# EAGLE design LPC1114_Bare_Metal_v01 (EAGLE 6.5.0)
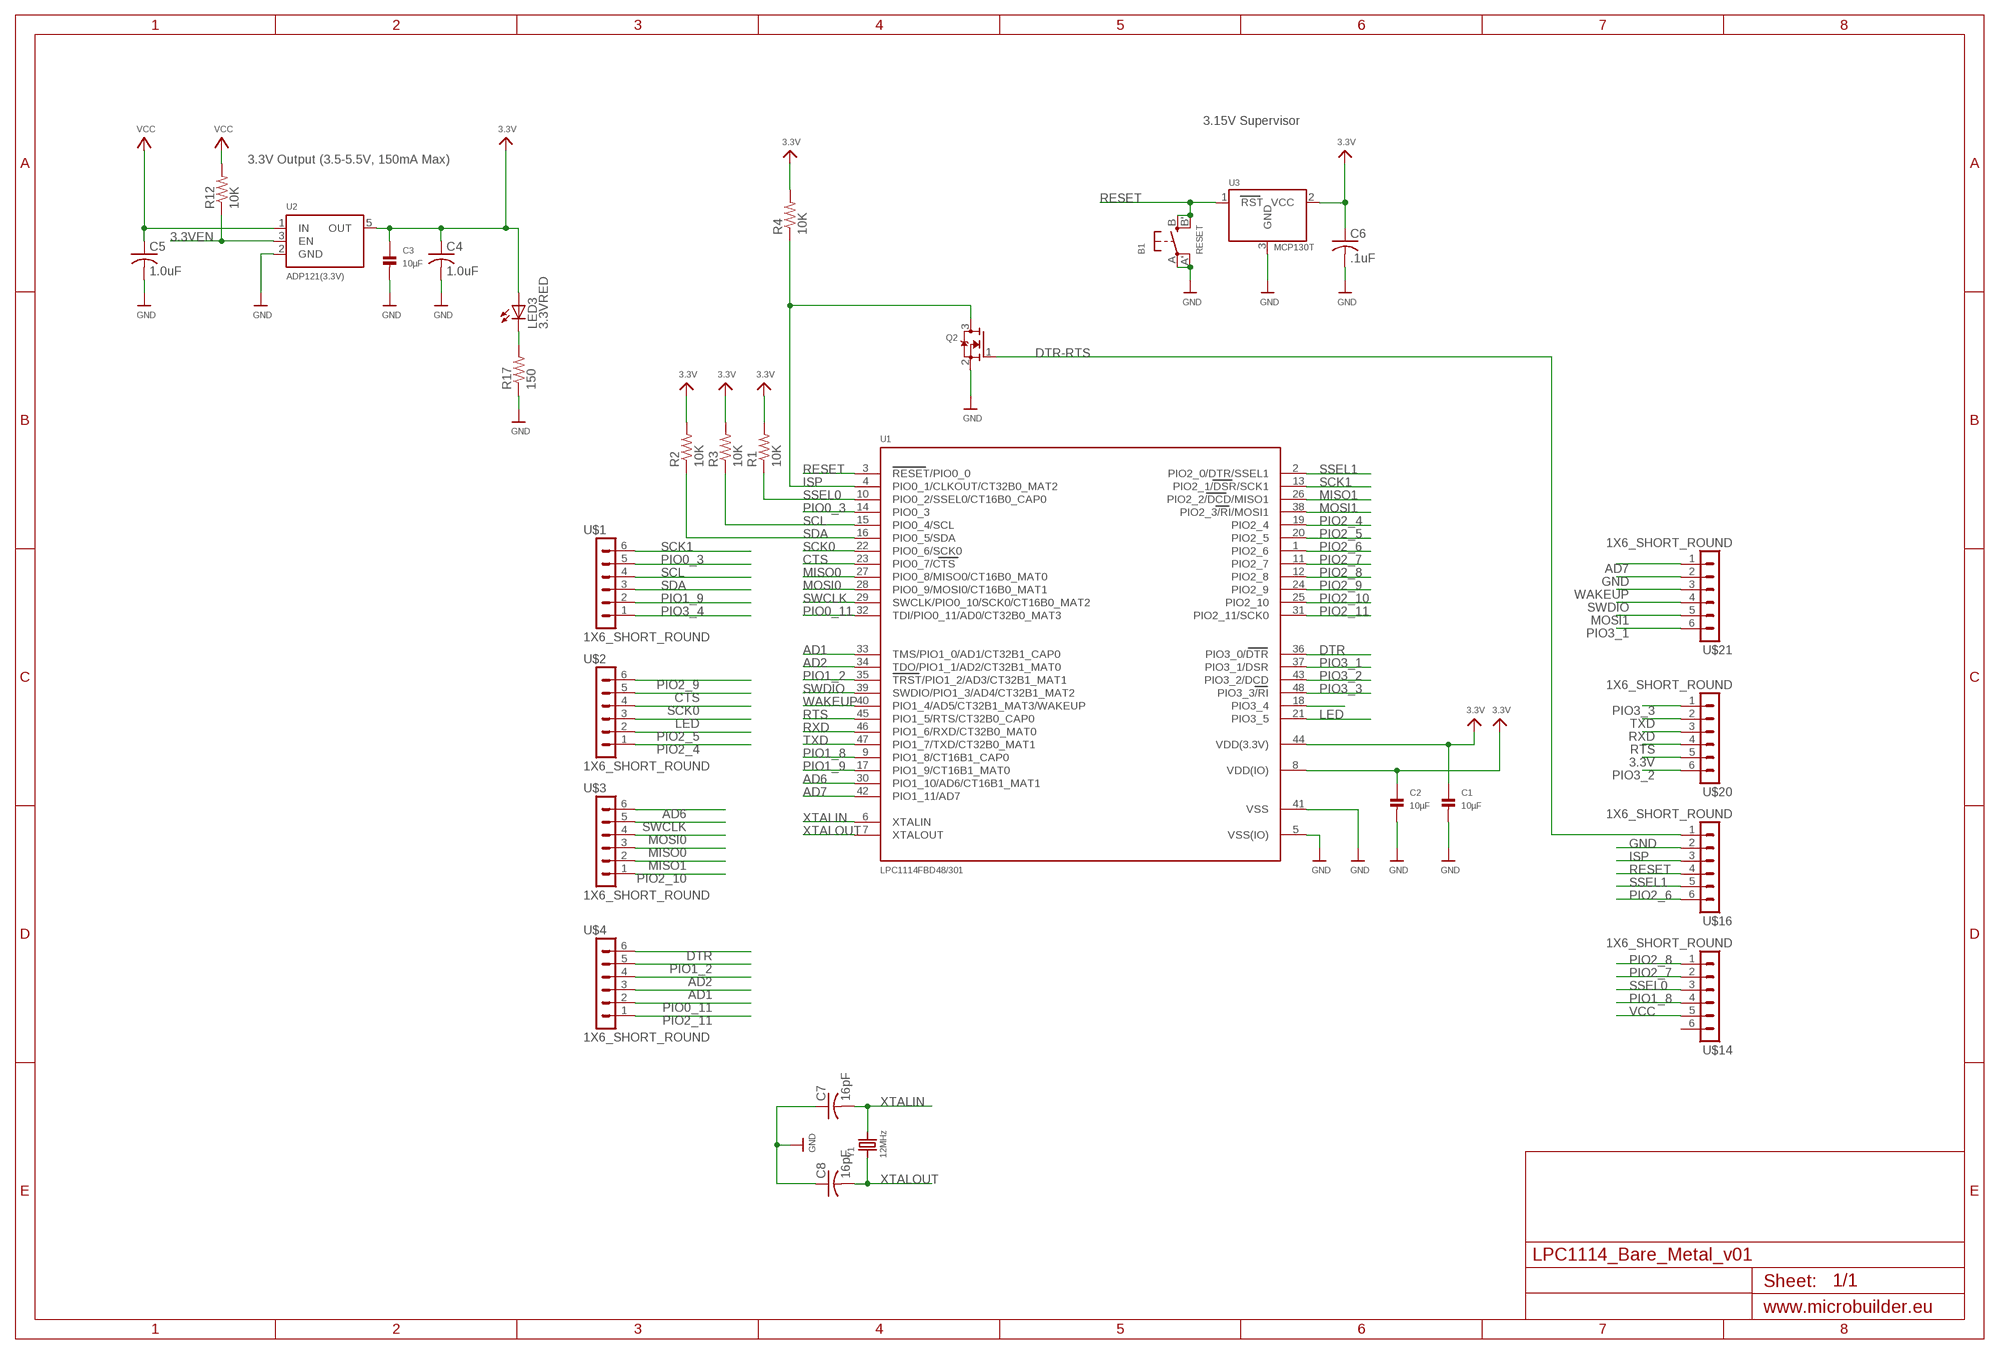
[diagram p0: schematic, sheet 1]

## Parts
B1  RESET  BUTTON_SMT  [EVQ-Q2]
C1  10µF  CAP_CERAMIC0805  [0805]
C2  10µF  CAP_CERAMIC0805  [0805]
C3  10µF  CAP_CERAMIC0805  [0805]
C4  1.0uF  C-USC0402K  [C0402K]
C5  1.0uF  C-USC0402K  [C0402K]
C6  .1uF  C-USC0402K  [C0402K]
C7  16pF  C-USC0402K  [C0402K]
C8  16pF  C-USC0402K  [C0402K]
LED3  3.3VRED  LEDSML0603  [SML0603]
Q2  MOSFET-NREFLOW  [SOT23]
R1  10K  R-US_R0402  [R0402]
R2  10K  R-US_R0402  [R0402]
R3  10K  R-US_R0402  [R0402]
R4  10K  R-US_R0402  [R0402]
R12  10K  R-US_R0402  [R0402]
R17  150  R-US_R0402  [R0402]
U1  LPC1114FBD48/301  LPC1113/4  [LQFP48]
U2  ADP121(3.3V)  ADP121  [SOT23-5]
U3  MCP130T  MCP130TREFLOW  [SOT23-R]
U$1  1X6_SHORT_ROUND  [1X6_SHORT_ROUND]
U$2  1X6_SHORT_ROUND  [1X6_SHORT_ROUND]
U$3  1X6_SHORT_ROUND  [1X6_SHORT_ROUND]
U$4  1X6_SHORT_ROUND  [1X6_SHORT_ROUND]
U$14  1X6_SHORT_ROUND  [1X6_SHORT_ROUND]
U$16  1X6_SHORT_ROUND  [1X6_SHORT_ROUND]
U$20  1X6_SHORT_ROUND  [1X6_SHORT_ROUND]
U$21  1X6_SHORT_ROUND  [1X6_SHORT_ROUND]
Y1  12MHz  CRYSTALTHIN  [CRYSTAL_3.2X2.5]

## Nets
3.3V: C1.1 C2.1 C3.1 C4.1 C6.1 LED3.A R1.2 R2.2 R3.2 R4.2 U1.8(VDD(IO)) U1.44(VDD(3.3V)) U2.5(OUT) U3.2(VCC) U$20.5
3.3VEN: R12.1 U2.3(EN)
AD1: U1.33(TMS/PIO1_0/AD1/CT32B1_CAP0) U$4.3
AD2: U1.34(TDO/PIO1_1/AD2/CT32B1_MAT0) U$4.4
AD6: U1.30(PIO1_10/AD6/CT16B1_MAT1) U$3.6
AD7: U1.42(PIO1_11/AD7) U$21.1
CTS: U1.23(PIO0_7/CTS) U$2.5
DTR: U1.36(PIO3_0/DTR) U$4.6
DTR-RTS: Q2.1(G) U$16.1
GND: B1.A'(P1) B1.A(P) C1.2 C2.2 C3.2 C4.2 C5.2 C6.2 C7.1 C8.1 Q2.2(S) R17.1 U1.5(VSS(IO)) U1.41(VSS) U2.2(GND) U3.3(GND) U$16.2 U$21.2
ISP: Q2.3(D) R4.1 U1.4(PIO0_1/CLKOUT/CT32B0_MAT2) U$16.3
LED: U1.21(PIO3_5) U$2.3
MISO0: U1.27(PIO0_8/MISO0/CT16B0_MAT0) U$3.3
MISO1: U1.26(PIO2_2/DCD/MISO1) U$3.2
MOSI0: U1.28(PIO0_9/MOSI0/CT16B0_MAT1) U$3.4
MOSI1: U1.38(PIO2_3/RI/MOSI1) U$21.5
N$10: LED3.C R17.2
PIO0_3: U1.14(PIO0_3) U$1.5
PIO0_11: U1.32(TDI/PIO0_11/AD0/CT32B0_MAT3) U$4.2
PIO1_2: U1.35(TRST/PIO1_2/AD3/CT32B1_MAT1) U$4.5
PIO1_8: U1.9(PIO1_8/CT16B1_CAP0) U$14.4
PIO1_9: U1.17(PIO1_9/CT16B1_MAT0) U$1.2
PIO2_4: U1.19(PIO2_4) U$2.1
PIO2_5: U1.20(PIO2_5) U$2.2
PIO2_6: U1.1(PIO2_6) U$16.6
PIO2_7: U1.11(PIO2_7) U$14.2
PIO2_8: U1.12(PIO2_8) U$14.1
PIO2_9: U1.24(PIO2_9) U$2.6
PIO2_10: U1.25(PIO2_10) U$3.1
PIO2_11: U1.31(PIO2_11/SCK0) U$4.1
PIO3_1: U1.37(PIO3_1/DSR) U$21.6
PIO3_2: U1.43(PIO3_2/DCD) U$20.6
PIO3_3: U1.48(PIO3_3/RI) U$20.1
PIO3_4: U1.18(PIO3_4) U$1.1
RESET: B1.B'(S1) B1.B(S) U1.3(RESET/PIO0_0) U3.1(RST) U$16.4
RTS: U1.45(PIO1_5/RTS/CT32B0_CAP0) U$20.4
RXD: U1.46(PIO1_6/RXD/CT32B0_MAT0) U$20.3
SCK0: U1.22(PIO0_6/SCK0) U$2.4
SCK1: U1.13(PIO2_1/DSR/SCK1) U$1.6
SCL: R3.1 U1.15(PIO0_4/SCL) U$1.4
SDA: R2.1 U1.16(PIO0_5/SDA) U$1.3
SSEL0: R1.1 U1.10(PIO0_2/SSEL0/CT16B0_CAP0) U$14.3
SSEL1: U1.2(PIO2_0/DTR/SSEL1) U$16.5
SWCLK: U1.29(SWCLK/PIO0_10/SCK0/CT16B0_MAT2) U$3.5
SWDIO: U1.39(SWDIO/PIO1_3/AD4/CT32B1_MAT2) U$21.4
TXD: U1.47(PIO1_7/TXD/CT32B0_MAT1) U$20.2
VCC: C5.1 R12.2 U2.1(IN) U$14.5
WAKEUP: U1.40(PIO1_4/AD5/CT32B1_MAT3/WAKEUP) U$21.3
XTALIN: C7.2 U1.6(XTALIN) Y1.2
XTALOUT: C8.2 U1.7(XTALOUT) Y1.1
Unconnected: U$14.6

## Notes on the sheet
- 3.15V Supervisor
- 3.3V Output (3.5-5.5V, 150mA Max)

## Library data of the parts
B1 = microbuilder:BUTTON_SMT: SMT Push Button (6mm) Digikey: P12940SCT-ND
C1-C3 = microbuilder:CAP_CERAMIC: Ceramic Capacitors 0603 - 0603 Surface Mount Capacitors 3pF 250V +/-0.1pF RF Ceramic Capacitor[Digikey: 712-1347-1-ND] 16 pF 50V 5% Ceramic Capacitor[Digikey: 445-5051-2-ND] 18 pF 250V 5% RF Ceramic Capcitor [Digikey: 478-3505-1-ND] 22 pF 50V Ceramic Capacitor [Digikey: PCC220ACVTR-ND] 33 pF 50V 5% Ceramic Capacitor 56 pF 250V 5% C0G RF Ceramic Capcitor [Digikey: 490-4867-1-ND] 680 pF 50V Ceramic Capacitor 2200 pF 50V 5% C0G Ceramic Capacitor [Digikey: 445-1297-1-ND] 5600 pF 100V 5% X7R Ceramic Capacitor [Digikey: 478-3711-1-ND] 0.1 µF 25V 10% Ceramic Capacitor [Digikey: PCC2277TR-ND] 0.22 µF 16V 10% X7R Ceramic Capacitor [Digikey: 445-1318-1-ND] 1.0 µF 25V 10% Ceramic Capacitor [Digikey: 445-5146-2-ND] 0805 - 0805 Surface Mount Capacitors 220 pF 250V 2% RF Ceramic Capacitor [Digikey: 712-1398-1-ND] 1000 pF 50V 2% NP0 Ceramic Capacitor [Digikey: 478-3760-1-ND] 0.1 µF 25V 10% Ceramic Capacitor [Digikey: PCC1828TR-ND] 1.0 µF 16V 10% Ceramic Capacitor[Digikey: 490-1691-2-ND] 10.0 µF 10V 10% Ceramic Capacitor[Digikey: 709-1228-1-ND] 1206 - 1206 Surface Mount Capacitors
C4-C8 = resistor:C-US: CAPACITOR, American symbol
LED3 = led:LED: LED OSRAM: - CHIPLED LG R971, LG N971, LY N971, LG Q971, LY Q971, LO R971, LY R971 LH N974, LH R974 LS Q976, LO Q976, LY Q976 LO Q996 - Hyper CHIPLED LW Q18S LB Q993, LB Q99A, LB R99A - SideLED LS A670, LO A670, LY A670, LG A670, LP A670 LB A673, LV A673, LT A673, LW A673 LH A674 LY A675 LS A676, LA A676, LO A676, LY A676, LW A676 LS A679, LY A679, LG A679 - Hyper Micro SIDELED® LS Y876, LA Y876, LO Y876, LY Y876 LT Y87S - SmartLED LW L88C, LW L88S LB L89C, LB L89S, LG L890 LS L89K, LO L89K, LY L89K LS L896, LA L896, LO L896, LY L896 - TOPLED LS T670, LO T670, LY T670, LG T670, LP T670 LSG T670, LSP T670, LSY T670, LOP T670, LYG T670 LG T671, LOG T671, LSG T671 LB T673, LV T673, LT T673, LW T673 LH T674 LS T676, LA T676, LO T676, LY T676, LB T676, LH T676, LSB T676, LW T676 LB T67C, LV T67C, LT T67C, LS T67K, LO T67K, LY T67K, LW E67C LS E67B, LA E67B, LO E67B, LY E67B, LB E67C, LV E67C, LT E67C LW T67C LS T679, LY T679, LG T679 LS T770, LO T770, LY T770, LG T770, LP T770 LB T773, LV T773, LT T773, LW T773 LH T774 LS E675, LA E675, LY E675, LS T675 LS T776, LA T776, LO T776, LY T776, LB T776 LHGB T686 LT T68C, LB T68C - Hyper Mini TOPLED® LB M676 - Mini TOPLED Santana® LG M470 LS M47K, LO M47K, LY M47K Source: http://www.osram.convergy.de LUXEON: - LUMILED® LXK2-PW12-R00, LXK2-PW12-S00, LXK2-PW14-U00, LXK2-PW14-V00 LXK2-PM12-R00, LXK2-PM12-S00, LXK2-PM14-U00 LXK2-PE12-Q00, LXK2-PE12-R00, LXK2-PE12-S00, LXK2-PE14-T00, LXK2-PE14-U00 LXK2-PB12-K00, LXK2-PB12-L00, LXK2-PB12-M00, LXK2-PB14-N00, LXK2-PB14-P00, LXK2-PB14-Q00 LXK2-PR12-L00, LXK2-PR12-M00, LXK2-PR14-Q00, LXK2-PR14-R00 LXK2-PD12-Q00, LXK2-PD12-R00, LXK2-PD12-S00 LXK2-PH12-R00, LXK2-PH12-S00 LXK2-PL12-P00, LXK2-PL12-Q00, LXK2-PL12-R00 Source: www.luxeon.com KINGBRIGHT: KA-3528ASYC Source: www.kingbright.com
Q2 = adafruit:MOSFET-N: N-Channel Mosfet 2N7002E - 60V 260mA SOT23 [Digikey: 2N7002ET1GOSTR-ND] - REEL BSH103 - 30V 850mA SOT23 [Digikey: 568-5013-1-ND]
R1-R4 R12 R17 = resistor:R-US_: RESISTOR, American symbol
U1 = microbuilder:LPC1113/4: LPC1113/4 MCU QFP48 Package ARM Cortex M0, 50MHz Operation, 8 Channel 10-Bit ADC, 1²C, 2xSPI, UART, 2x16 Bit and 2x32 Bit Timers, Internal 12MHz Oscillator, 1.8-3.6V operation. Model Flash SRAM Part N°: Digikey # LPC1113 24KB 8KB LPC1113FBD48/301 TBD LPC1114 32KB 8KB LPC1114FBD48/301 TBD
U2 = microbuilder:ADP121: LDO Fixed Voltage Regulator 150mA The ADP121 voltage regulator is ideal for regulating battery or solar power due to it's very low foreward voltage drop (maximum 90mV at 150mA). Forward Voltage Dropout: 90mV at 150mA Input Voltage Range: 2.3V-5.5V Output Voltage Range: 1.2V-3.3V (depending on model) Digikey: 3.3V - ADP121-AUJZ33R7CT-ND
U3 = microbuilder:MCP130T: MCP130T Voltage Supervisor (Active Low) Voltage supervisors will put the MCU in a reset state if the voltage drops below a pre-determined level. SOT23-R/SOT23-W: Voltage Supervisor - 3.15V Active Low Note: Use the "Reflow" footprint when working with solder paste, and the "Wave" footprint when soldering by hand with a soldering iron (the latter has larger pads that are easier to solder by hand). Digikey: MCP130T-315I/TTCT-ND
U$1-U$4 U$14 U$16 U$20 U$21 = Random parts(01-14-14):1X6_SHORT_ROUND
Y1 = microbuilder:CRYSTAL: Crystals HC49UP - Surface Mount Crystal 12.0 MHz Surface Mount Crystal [Digikey: 535-9869-6-ND] 25.0 MHz Surface Mount Crystal [Digikey: 535-9078-1-ND] 3.2 x 2.5mm - MEMs SMT Crystal 12.0 MHz 3.2 x 2.5mm Crystal [Digikey: 644-1047-1-ND] 16.0 MHz 3.2 x 2.5mm Crystal [Digikey: 644-1100-1-ND] 4.9 x 1.8mm - MEMs SMT Crystal 32.768 KHz 4.9 x 1.8mm Crystal [Digikey: SE2415CT-ND] Cylinder 32.768KHz Cylinder Crystal

## Board
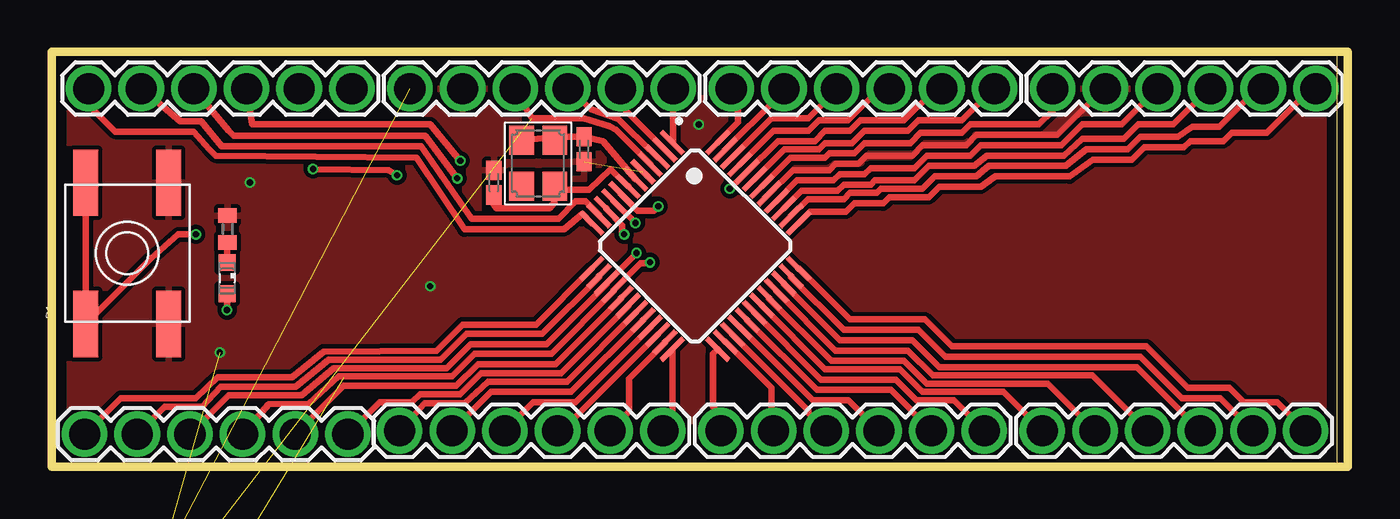
[diagram p1: board, top side]
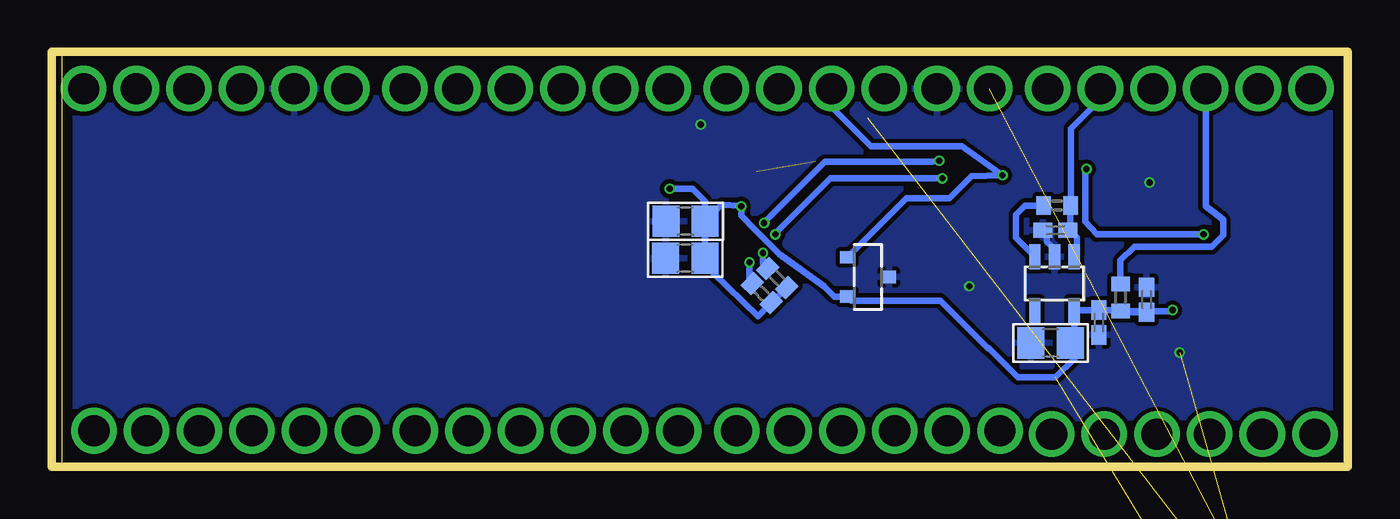
[diagram p2: board, bottom side, seen from below]

Size 62.5 x 20 mm. Coordinates in mm from the lower left corner, seen from the top.
Outline: 62,0 62,20
Outline: 0,20 62.5,20 62.5,0 0,0 0,20
Copper layers (1*16): Top 0.035mm / dielectric 1.5mm / Bottom 0.035mm
Design rules "PCBCart-.1mmAnnulars": minimum track width 8mil, minimum drill 0.4mm, track to track 8mil, track to pad 8mil, pad to pad 8mil, via to via 8mil, smd to smd 8mil, copper to edge 20mil, drill to drill 8mil, minimum pad ring 8mil, minimum via ring 4mil, stop-mask expansion 3mil, vias tented up to drill 0mil, thermal gap 8mil

### Footprints (pad centres in the part's own frame; a part is rotated, then mirrored left to right if it is on the bottom)
EVQ-Q2 = smd 3.2 x 1.2: A -3.4,-2; A' 3.4,-2; B -3.4,2; B' 3.4,2
0805 = smd 1.3 x 1.5: 1 -0.95,0; 2 0.95,0
C0402K = smd 0.925 x 0.74: 1 -0.6,0; 2 0.6,0
SML0603 = smd 0.8 x 0.8: A 0.75,0; C -0.75,0
SOT23 = smd 1 x 1.4: 1 -0.95,-1.1; 2 0.95,-1.1; 3 0,1.1
R0402 = smd 0.7 x 0.9: 1 -0.65,0; 2 0.65,0
LQFP48 = smd 1.5 x 0.25: 1 -4.3,2.75; 2 -4.3,2.25; 3 -4.3,1.75; 4 -4.3,1.25; 5 -4.3,0.75; 6 -4.3,0.25; 7 -4.3,-0.25; 8 -4.3,-0.75; 9 -4.3,-1.25; 10 -4.3,-1.75; 11 -4.3,-2.25; 12 -4.3,-2.75; 25 4.3,-2.75; 26 4.3,-2.25; 27 4.3,-1.75; 28 4.3,-1.25; 29 4.3,-0.75; 30 4.3,-0.25; 31 4.3,0.25; 32 4.3,0.75; 33 4.3,1.25; 34 4.3,1.75; 35 4.3,2.25; 36 4.3,2.75 | smd 0.25 x 1.5: 13 -2.75,-4.3; 14 -2.25,-4.3; 15 -1.75,-4.3; 16 -1.25,-4.3; 17 -0.75,-4.3; 18 -0.25,-4.3; 19 0.25,-4.3; 20 0.75,-4.3; 21 1.25,-4.3; 22 1.75,-4.3; 23 2.25,-4.3; 24 2.75,-4.3; 37 2.75,4.3; 38 2.25,4.3; 39 1.75,4.3; 40 1.25,4.3; 41 0.75,4.3; 42 0.25,4.3; 43 -0.25,4.3; 44 -0.75,4.3; 45 -1.25,4.3; 46 -1.75,4.3; 47 -2.25,4.3; 48 -2.75,4.3
SOT23-5 = smd 0.55 x 1.2: 1 -0.95,-1.3; 2 0,-1.3; 3 0.95,-1.3; 4 0.95,1.3; 5 -0.95,1.3
SOT23-R = smd 0.6 x 0.7: 1 -0.95,-1; 2 0.95,-1; 3 0,1
1X6_SHORT_ROUND = drill 1.5 pad 2.2: 1 1.27,-1.27; 2 3.81,-1.27; 3 6.35,-1.27; 4 8.89,-1.27; 5 11.43,-1.27; 6 13.97,-1.27
CRYSTAL_3.2X2.5 = smd 1.4 x 1.2: 1 -1.1,-0.8; 2 1.1,0.8; GND1 -1.1,0.8; GND2 1.1,-0.8

### Placement (x,y rotation side)
B1  3.64,10.29 90 top
C1  31.94,11.83 180 bottom
C2  31.95,10.05 180 bottom
C3  14.33,5.96 180 bottom
C4  9.7,8.05 90 bottom
C5  14.1,11.4 180 bottom
C6  12,6.95 270 bottom
C7  25.67,15.3 90 top
C8  21.32,13.69 270 top
LED3  8.46,9.09 270 top
Q2  1.9,-11.85 0 top  (outside the outline)
R1  10.96,8.15 270 bottom
R2  28.26,8.37 315 bottom
R3  27.51,9.09 315 bottom
R4  1,-16.2 0 top  (outside the outline)
R12  14.02,12.59 0 bottom
R17  8.48,11.46 270 top
U1  31.03,10.65 315 top
U2  14.14,8.83 180 bottom
U3  23.14,9.15 270 bottom
U$1  15.55,0.3 180 top
U$2  15.5,3 0 top
U$3  31,3 0 top
U$4  46.5,3 0 top
U$14  0.5,19.5 0 top
U$16  16,19.5 0 top
U$20  31.5,19.5 0 top
U$21  47,19.5 0 top
Y1  23.46,14.63 90 top

### Tracks (layer width: path | path; a pad name or v marks a point on that pad's centre or on a via)
3.3V  (via drill 0.3)  (1 unrouted)
  Top 0.305: U$20.5 42.63,18.23 41.1,16.7 39,16.7 38.5,16.2 37.3,16.2 36.8,15.7 35.02,15.7 U1.44 32.72,13.4 v32.7,13.4 | U1.8 27.45,13.15 28.25,12.35 29.05,12.35 v29.25,12.55 | v8.45,7.55 8.45,7.83 LED3.A
  Bottom 0.305: C2.1 30.99,10.06 | 29.27,12.57 29.25,12.09 28.6,11.45 27.4,10.25 25.25,8.7 24.75,8.2 U3.2 23.94,8 19.65,8 17.35,5.7 17.3,5.7 15.9,4.3 14.1,4.3 13.19,5.21 U2.5 | v29.25,12.55 29.3,12.6 | v29.25,12.55 | v29.25,12.55 29.27,12.57 | R3.2 R2.2 28.45,7.25 30.65,9.4 30.65,9.7 C2.1 | U2.5 13.19,6.16 C3.1 | U2.5 13.17,7.55 C6.1 11.01,7.55 R1.2 9.75,7.5 | 10.55,7.45 C4.1 9.75,7.5 | 9.75,7.5 8.5,7.5 v8.45,7.55 | 29.27,12.57 30.2,12.62 C1.1 | v32.7,13.4 31.6,13.4 31,12.8 31,11.85 C1.1 | C2.1 31,11.82 C1.1
3.3VEN
  Bottom 0.305: R12.1 15.56,12.59 16,12.15 16,11.04 U2.3
AD1
  Top 0.305: U1.33 34.95,8.45 37.8,5.6 41.3,5.6 42.5,4.4 50.18,4.4 U$4.3
AD2
  Top 0.305: U1.34 35.3,8.8 38,6.1 41.5,6.1 42.8,4.8 52.32,4.8 U$4.4
AD6
  Top 0.305: U1.30 33.89,7.41 37.1,4.2 40.7,4.2 41.7,3.2 43.5,3.2 U$3.6
AD7
  Top 0.305: U$21.1 48.27,17.17 47.6,16.5 44.3,16.5 43.9,16.1 41.9,16.1 41.4,15.6 39.2,15.6 38.7,15.1 37.5,15.1 37.3,14.9 35.63,14.9 U1.42
CTS
  Top 0.305: U1.23 29.58,5.98 27.85,4.25 27.85,2.65 U$2.5
DTR
  Top 0.305: U1.36 36.05,9.55 38.5,7.1 42.1,7.1 43.4,5.8 52.8,5.8 54.8,3.8 56.8,3.8 57.5,3.1 59.1,3.1 U$4.6
DTR-RTS  (1 unrouted)
GND  (via drill 0.3)  (2 unrouted)
  Top 0.305: U$21.2 50.73,18.23 48.5,16 44.6,16 44.1,15.5 42,15.5 41.5,15 39.3,15 38.9,14.6 37.8,14.6 37.5,14.3 35.74,14.3 U1.41
  Bottom 0.305: U2.2 14.14,10.49 14.5,10.85 14.5,11.2 C5.2
  other vias: 31.2,16.5 8.1,5.5 9.55,13.7 18.25,8.7
  pour Bottom (isolate 0.203): 0,0 0,20 62,20 62,0
  pour Top (isolate 0.203): 0.2,0 0.2,20 62.2,20 62.2,0
ISP  (2 unrouted)
  Top 0.305: U$16.3 22.35,18.1 23.15,16.8 25.64,16.8 26.89,16.41 27.2,16.25 28.1,15.35 U1.4
LED
  Top 0.305: U1.21 25.25,3.1 23.22,3.1 U$2.3
MISO0
  Top 0.305: U1.27 36.5,2.7 36.5,2.58 U$3.3
MISO1
  Top 0.305: U1.26 32.48,6.02 34.7,3.8 34.7,1.84 U$3.2
MOSI0
  Top 0.305: U1.28 36.7,3.2 38.42,3.2 U$3.4
MOSI1
  Top 0.305: U$21.5 58.13,18.23 56.3,16.4 55,16.4 54.3,15.9 52.5,15.9 51.9,15.3 49.9,15.3 48.9,14.5 45.2,14.5 44.6,14 42.6,14 42,13.4 40,13.4 39.8,13.2 38.5,13.2 38.2,12.9 36.46,12.9 U1.38
N$1
  pour Top: 21.05,15 21.05,14.25 21.1,14.2 21.65,14.2 21.9,14.45 21.9,14.75 21.55,15.1 21.15,15.1
N$10
  Top 0.305: LED3.C 8.46,10.79 R17.2
PIO0_3
  Top 0.305: U1.14 26.39,9.14 23.65,6.4 20,6.4 18.75,5.15 13.35,5.15 11.75,3.85 8.15,3.85 7.25,2.9 5.45,2.9 U$1.5
PIO0_11
  Top 0.305: U1.32 34.6,8.1 37.6,5.1 41.1,5.1 42.2,4 48.04,4 U$4.2
PIO1_2
  Top 0.305: U1.35 35.66,9.14 38.2,6.6 41.8,6.6 43.1,5.3 52.5,5.3 54.5,3.3 56.36,3.3 U$4.5
PIO1_8  (via drill 0.3)
  Top 0.305: U1.9 v28.15,11.75 | U$14.4 9.67,16.5 18.25,16.5 v19.7,14.75
  Bottom 0.305: v28.15,11.75 25.2,14.7 20.05,14.7 v19.7,14.75
PIO1_9
  Top 0.305: U1.17 27.45,8.1 24.3,4.95 20.55,4.95 19.5,3.9 14.07,3.9 U$1.2
PIO2_4
  Top 0.305: U1.19 28.16,7.41 24.85,4.1 21.05,4.1 19.9,3.05 17.99,3.05 U$2.1
PIO2_5
  Top 0.305: U1.20 28.52,7.07 25.05,3.6 21.18,3.6 U$2.2
PIO2_6
  Top 0.305: U$16.6 29.97,15.67 U1.1
PIO2_7
  Top 0.305: U$14.2 4.37,18.23 6.2,16.65 7.2,16.65 8.2,15.45 17.8,15.45 20.25,11.95 24.45,11.95 25.25,12.8 25.75,12.8 26.39,12.16 U1.11
PIO2_8
  Top 0.305: U$14.1 1.77,17.43 3.05,16.15 6.85,16.15 7.6,15.3 7.9,15 17.6,14.9 19.91,11.44 24.7,11.45 25.59,12.19 U1.12
PIO2_9
  Top 0.305: U1.24 29.93,2.19 U$2.6
PIO2_10
  Top 0.305: U$3.1 32.27,2.53 31.9,2.9 31.9,5.44 U1.25
PIO2_11
  Top 0.305: U1.31 34.24,7.76 37.3,4.7 40.9,4.7 42,3.6 45.9,3.6 U$4.1
PIO3_1
  Top 0.305: U$21.6 60.73,18.23 58.6,16.1 56.9,16.1 56.5,15.7 54.9,15.7 54.6,15.4 52.7,15.4 52.1,14.8 50.2,14.8 49.1,14 45.5,14 44.8,13.5 42.8,13.5 42.3,13 40.4,13 40.1,12.7 38.7,12.7 38.3,12.3 36.57,12.3 U1.37
PIO3_2
  Top 0.305: U$20.6 45.43,18.23 43.9,16.7 41.8,16.7 41.3,16.2 39.2,16.2 38.6,15.6 37.3,15.6 37,15.3 35.33,15.3 U1.43
PIO3_3
  Top 0.305: U1.48 32.13,15.63 33.1,16.6 33.1,17.9 U$20.1
PIO3_4
  Top 0.305: U1.18 27.81,7.76 24.55,4.5 20.7,4.5 19.7,3.5 17.75,3.5 17.35,3.1 15.81,3.1 U$1.1
RESET  (via drill 0.3)
  Top 0.305: U$16.4 26.02,17.23 27.32,16.78 27.8,16.3 U1.3 | B1.B' B1.B | B1.B 1.64,6.64 1.4,6.4 1.4,6.64 B1.B | B1.B 4.8,10.05 6.1,11.2 v6.95,11.2 | v12.6,14.35 16.25,14.3 v16.65,14.05
  Bottom 0.305: U$16.4 24.92,17.93 24.92,17.37 23,15.45 18.6,15.45 v16.65,14.05 18.15,14 19.2,12.95 21.28,12.95 U3.1 | v6.95,11.2 12.1,11.2 12.65,11.8 12.65,14.25 v12.6,14.35
RTS
  Top 0.305: U$20.4 39.93,18.23 38.4,16.7 37,16.7 36.5,16.2 34.81,16.2 U1.45
RXD
  Top 0.305: U$20.3 37.85,18.15 36.5,16.8 34.7,16.8 U1.46
SCK0
  Top 0.305: U1.22 25.1,2.25 24.91,2.25 U$2.4
SCK1
  Top 0.305: U1.13 23.35,6.85 19.8,6.85 18.55,5.6 13.1,5.55 11.6,4.3 8,4.3 6.95,3.3 3.31,3.3 U$1.6
SCL  (via drill 0.3)
  Top 0.305: U$1.4 8.54,3.45 12.05,3.45 13.6,4.75 19.05,4.75 20.2,5.9 23.85,5.9 26.75,8.8 U1.15 v28.2,10.3
  Bottom 0.305: v28.2,10.3 28.2,9.78 R3.1
SDA  (via drill 0.3)
  Top 0.305: U$1.3 10.45,3 12.38,3.03 13.83,4.35 19.3,4.35 20.4,5.45 24.1,5.45 27.1,8.45 U1.16 27.1,8.5 28.4,9.8 28.8,9.8 v28.85,9.85
  Bottom 0.305: v28.85,9.85 28.85,8.96 R2.1
SSEL0  (via drill 0.3)
  Top 0.305: U1.10 26.75,12.4 27.5,11.65 27.5,11.3 v27.6,11.2 | U$14.3 8.53,16.2 8.78,15.95 18,15.95 19.4,14.1 v19.55,13.9
  Bottom 0.305: v27.6,11.2 27.6,11.25 24.95,13.9 v19.55,13.9 | R1.1 10.96,9.94 10.3,10.6 6.55,10.6 6,11.15 6,11.9 6.85,12.55 U$14.3
SSEL1
  Top 0.305: U$16.5 27.43,17.42 U1.2
SWCLK
  Top 0.305: U1.29 33.53,7.07 36.9,3.7 40.46,3.7 U$3.5
SWDIO
  Top 0.305: U$21.4 55.83,18.23 54.1,16.5 52.4,16.5 51.7,15.8 49.7,15.8 48.8,15 45.1,15 44.5,14.5 42.3,14.5 41.6,13.8 39.7,13.8 39.5,13.6 38.2,13.6 37.9,13.3 36.15,13.3 U1.39
TXD
  Top 0.305: U1.47 34.9,17.7 34.9,17.82 U$20.2
VCC
  Bottom 0.305: U$14.5 11.93,17.72 13.35,16.3 13.35,12.61 R12.2 13.37,11.53 C5.1 13.4,11.4 13.05,11.05 13.05,10.27 U2.1
WAKEUP
  Top 0.305: U$21.3 53.33,18.23 51.6,16.5 49.7,16.5 48.7,15.5 44.8,15.5 44.3,15 42.2,15 41.6,14.4 39.5,14.4 39.2,14.1 38,14.1 37.7,13.8 35.95,13.8 U1.40
XTALIN
  Top 0.305: U1.6 26.58,15.7 C7.2 24.44,15.9 Y1.2
XTALOUT
  Top 0.305: U1.7 27.79,13.51 26.95,14.35 25.9,13.35 24.25,13.35 24.26,13.36 Y1.1 24.26,12.76 24,12.45 21.45,12.45 21.3,12.65 21.1,13.12 C8.2